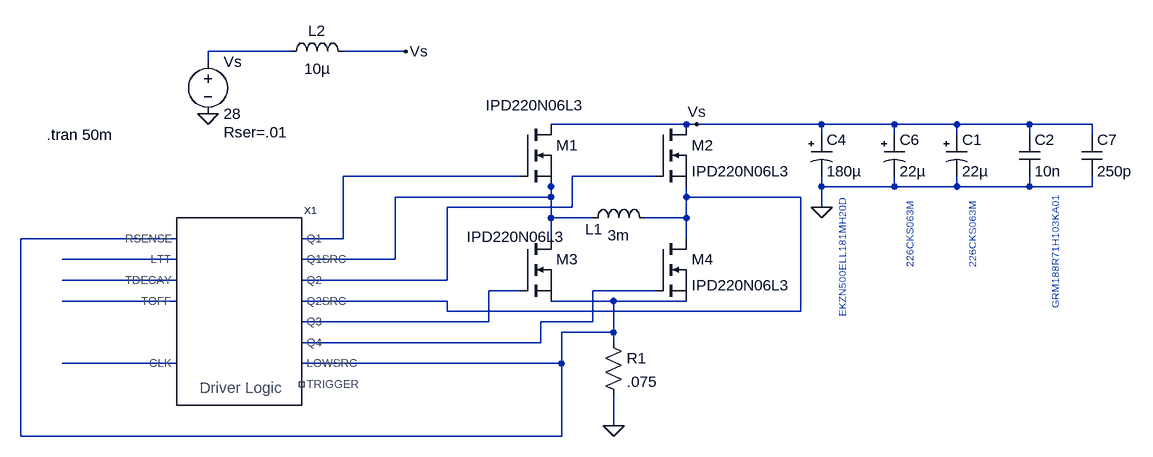
[diagram p0: schematic hbridge.asc]
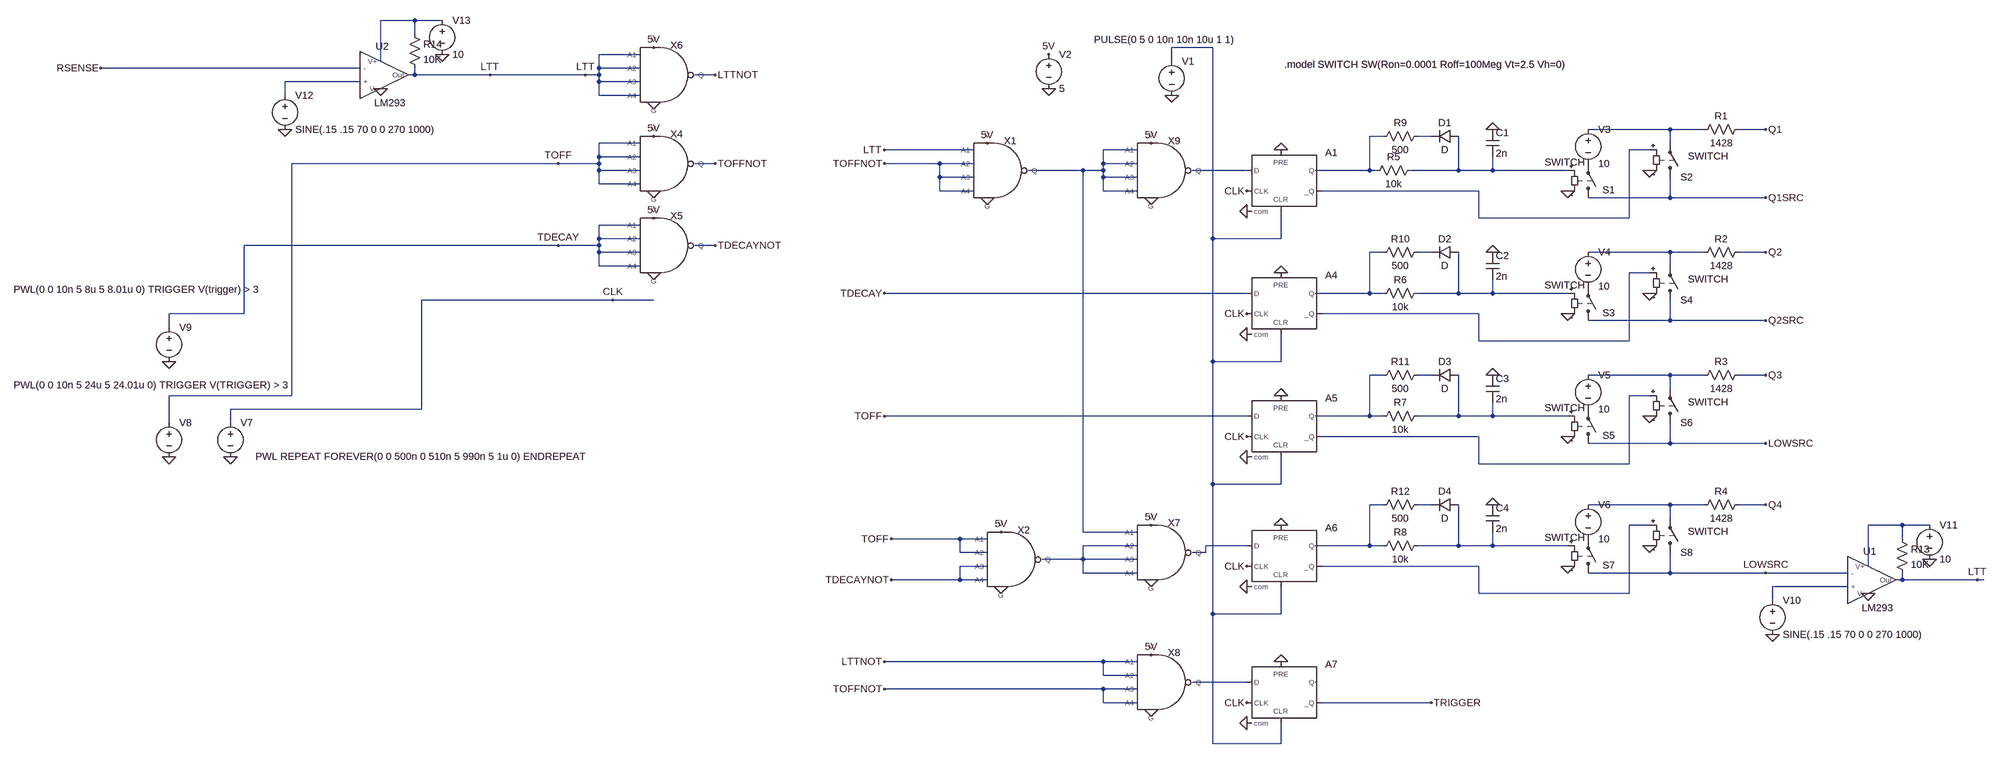
[diagram p1: sub-circuit state.asc]
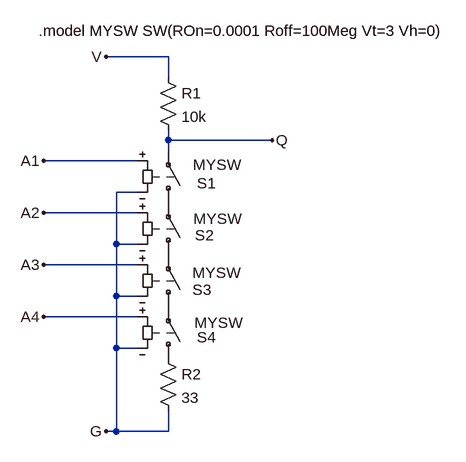
[diagram p2: sub-circuit mynand.asc]
hbridge.asc, the LTspice schematic file:
Version 4
SHEET 1 5128 2404
WIRE -176 -80 -304 -80
WIRE 0 -80 -96 -80
WIRE -304 -64 -304 -80
WIRE 432 32 224 32
WIRE 448 32 432 32
WIRE 640 32 448 32
WIRE 752 32 640 32
WIRE 848 32 752 32
WIRE 960 32 848 32
WIRE 1056 32 960 32
WIRE 640 48 640 32
WIRE 752 48 752 32
WIRE 848 48 848 32
WIRE 960 48 960 32
WIRE 1056 48 1056 32
WIRE 176 112 -96 112
WIRE 384 112 256 112
WIRE 224 128 224 112
WIRE 640 128 640 112
WIRE 752 128 752 112
WIRE 752 128 640 128
WIRE 848 128 848 112
WIRE 848 128 752 128
WIRE 960 128 960 112
WIRE 960 128 848 128
WIRE 1056 128 1056 112
WIRE 1056 128 960 128
WIRE 224 144 224 128
WIRE 224 144 -16 144
WIRE 432 144 432 128
WIRE 608 144 432 144
WIRE 256 160 256 112
WIRE 256 160 64 160
WIRE 640 160 640 128
WIRE 224 176 224 144
WIRE 288 176 224 176
WIRE 432 176 432 144
WIRE 432 176 368 176
WIRE -352 208 -592 208
WIRE -96 208 -96 112
WIRE -96 208 -160 208
WIRE 224 208 224 176
WIRE 432 208 432 176
WIRE -352 240 -528 240
WIRE -16 240 -16 144
WIRE -16 240 -160 240
WIRE -352 272 -528 272
WIRE 64 272 64 160
WIRE 64 272 -160 272
WIRE 176 288 128 288
WIRE 384 288 288 288
WIRE -352 304 -528 304
WIRE 64 304 -160 304
WIRE 320 304 224 304
WIRE 432 304 320 304
WIRE 64 320 64 304
WIRE 608 320 608 144
WIRE 608 320 64 320
WIRE 128 336 128 288
WIRE 128 336 -160 336
WIRE 288 336 288 288
WIRE 288 336 208 336
WIRE 320 352 320 304
WIRE 320 352 240 352
WIRE 208 368 208 336
WIRE 208 368 -160 368
WIRE 320 368 320 352
WIRE -352 400 -528 400
WIRE 240 400 240 352
WIRE 240 400 -160 400
WIRE 320 496 320 448
WIRE -592 512 -592 208
WIRE 240 512 240 400
WIRE 240 512 -592 512
FLAG 320 496 0
FLAG -304 16 0
FLAG 448 32 Vs
FLAG 0 -80 Vs
FLAG 640 160 0
SYMBOL nmos 176 32 R0
WINDOW 3 -53 -29 Left 2
SYMATTR Value IPD220N06L3
SYMATTR InstName M1
SYMBOL nmos 384 32 R0
SYMATTR InstName M2
SYMATTR Value IPD220N06L3
SYMBOL nmos 384 208 R0
SYMATTR InstName M4
SYMATTR Value IPD220N06L3
SYMBOL nmos 176 208 R0
WINDOW 3 -82 -3 Left 2
SYMATTR Value IPD220N06L3
SYMATTR InstName M3
SYMBOL ind 272 192 R270
WINDOW 0 -17 18 VTop 2
WINDOW 3 5 56 VBottom 2
SYMATTR InstName L1
SYMATTR Value 3m
SYMATTR SpiceLine Ipk=2 Rser=2.25
SYMBOL res 304 352 R0
SYMATTR InstName R1
SYMATTR Value .075
SYMATTR SpiceLine pwr=2
SYMBOL voltage -304 -80 R0
WINDOW 123 0 0 Left 2
WINDOW 39 24 124 Left 2
SYMATTR SpiceLine Rser=.01
SYMATTR InstName Vs
SYMATTR Value 28
SYMBOL ind -192 -64 R270
WINDOW 0 32 56 VTop 2
WINDOW 3 5 56 VBottom 2
SYMATTR InstName L2
SYMATTR Value 10µ
SYMBOL cap 944 48 R0
SYMATTR InstName C2
SYMATTR Value 10n
SYMATTR SpiceLine V=50 Irms=272m Rser=0.1 Lser=0
SYMBOL cap 1040 48 R0
SYMATTR InstName C7
SYMATTR Value 250p
SYMATTR SpiceLine V=50 Irms=10 Rser=100u Lser=.01p
SYMBOL polcap 736 48 R0
WINDOW 3 24 56 Left 2
SYMATTR Value 22µ
SYMATTR InstName C6
SYMATTR Description Capacitor
SYMATTR Type cap
SYMATTR SpiceLine V=63 Irms=368m Rser=7.5m
SYMBOL state -256 240 R0
SYMATTR InstName X1
SYMBOL polcap 832 48 R0
WINDOW 3 24 56 Left 2
SYMATTR Value 22µ
SYMATTR InstName C1
SYMATTR Description Capacitor
SYMATTR Type cap
SYMATTR SpiceLine V=63 Irms=368m Rser=7.5m
SYMBOL polcap 624 48 R0
WINDOW 3 24 56 Left 2
SYMATTR Value 180µ
SYMATTR InstName C4
SYMATTR Description Capacitor
SYMATTR Type cap
SYMATTR SpiceLine V=50 Irms=1.96 Rser=49m Lser=12n
TEXT -552 48 Left 2 !.tran 50m
TEXT 672 328 VLeft 1 ;EKZN500ELL181MH20D
TEXT 1000 144 VRight 1 ;GRM188R71H103KA01
TEXT 776 152 VRight 1 ;226CKS063M
TEXT 872 152 VRight 1 ;226CKS063M

state.asc, the sub-circuit schematic file:
Version 4
SHEET 1 2296 1748
WIRE -1504 -464 -1584 -464
WIRE -1440 -464 -1504 -464
WIRE -1504 -432 -1504 -464
WIRE 464 -400 368 -400
WIRE -976 -384 -1072 -384
WIRE -1584 -368 -1584 -464
WIRE 368 -368 368 -400
WIRE -1632 -352 -2240 -352
WIRE -1072 -352 -1072 -384
WIRE -976 -352 -1072 -352
WIRE -1504 -336 -1504 -352
WIRE -1504 -336 -1520 -336
WIRE -1328 -336 -1504 -336
WIRE -1104 -336 -1328 -336
WIRE -1072 -336 -1072 -352
WIRE -1072 -336 -1104 -336
WIRE -800 -336 -848 -336
WIRE -1632 -320 -1808 -320
WIRE -1072 -320 -1072 -336
WIRE -976 -320 -1072 -320
WIRE -1808 -288 -1808 -320
WIRE -1072 -288 -1072 -320
WIRE -976 -288 -1072 -288
WIRE 1536 -208 1344 -208
WIRE 1616 -208 1536 -208
WIRE 1760 -208 1696 -208
WIRE 864 -192 832 -192
WIRE 976 -192 944 -192
WIRE -976 -176 -1072 -176
WIRE 1536 -176 1536 -208
WIRE -96 -160 -320 -160
WIRE 288 -160 208 -160
WIRE 1488 -160 1440 -160
WIRE -1072 -144 -1072 -176
WIRE -976 -144 -1072 -144
WIRE -1168 -128 -1792 -128
WIRE -1072 -128 -1072 -144
WIRE -1072 -128 -1168 -128
WIRE -800 -128 -848 -128
WIRE -176 -128 -320 -128
WIRE -96 -128 -176 -128
WIRE 208 -128 208 -160
WIRE 288 -128 208 -128
WIRE -1072 -112 -1072 -128
WIRE -976 -112 -1072 -112
WIRE 160 -112 32 -112
WIRE 208 -112 208 -128
WIRE 208 -112 160 -112
WIRE 544 -112 416 -112
WIRE 832 -112 832 -192
WIRE 832 -112 704 -112
WIRE 848 -112 832 -112
WIRE 1040 -112 1040 -192
WIRE 1040 -112 928 -112
WIRE 1120 -112 1120 -144
WIRE 1120 -112 1040 -112
WIRE 1296 -112 1120 -112
WIRE -176 -96 -176 -128
WIRE -96 -96 -176 -96
WIRE 208 -96 208 -112
WIRE 288 -96 208 -96
WIRE -1072 -80 -1072 -112
WIRE -976 -80 -1072 -80
WIRE -176 -64 -176 -96
WIRE -96 -64 -176 -64
WIRE 208 -64 208 -96
WIRE 288 -64 208 -64
WIRE 1088 -64 720 -64
WIRE 1536 -48 1536 -96
WIRE 1536 -48 1344 -48
WIRE 1760 -48 1536 -48
WIRE 1088 0 1088 -64
WIRE 1440 0 1440 -160
WIRE 1440 0 1088 0
WIRE -976 16 -1072 16
WIRE -1072 48 -1072 16
WIRE -976 48 -1072 48
WIRE 464 48 464 -400
WIRE 624 48 624 -16
WIRE 624 48 464 48
WIRE -1168 64 -1904 64
WIRE -1072 64 -1072 48
WIRE -1072 64 -1168 64
WIRE -800 64 -848 64
WIRE -1072 80 -1072 64
WIRE -976 80 -1072 80
WIRE 864 80 832 80
WIRE 976 80 944 80
WIRE 1536 80 1344 80
WIRE 1616 80 1536 80
WIRE 1760 80 1696 80
WIRE -1072 112 -1072 80
WIRE -976 112 -1072 112
WIRE 1536 112 1536 80
WIRE 1488 128 1440 128
WIRE 544 176 -320 176
WIRE 832 176 832 80
WIRE 832 176 704 176
WIRE 864 176 832 176
WIRE 1040 176 1040 80
WIRE 1040 176 944 176
WIRE 1120 176 1120 144
WIRE 1120 176 1040 176
WIRE 1296 176 1120 176
WIRE -1040 192 -1488 192
WIRE -944 192 -1040 192
WIRE -1904 224 -1904 64
WIRE -1904 224 -2080 224
WIRE 1088 224 720 224
WIRE 1536 240 1536 192
WIRE 1536 240 1344 240
WIRE 1760 240 1536 240
WIRE -2080 256 -2080 224
WIRE 1088 288 1088 224
WIRE 1440 288 1440 128
WIRE 1440 288 1088 288
WIRE 464 336 464 48
WIRE 624 336 624 272
WIRE 624 336 464 336
WIRE 864 368 832 368
WIRE 976 368 944 368
WIRE 1536 368 1344 368
WIRE 1616 368 1536 368
WIRE 1760 368 1696 368
WIRE 1536 400 1536 368
WIRE -1792 416 -1792 -128
WIRE -1792 416 -2080 416
WIRE 1488 416 1440 416
WIRE -1488 448 -1488 192
WIRE -1488 448 -1936 448
WIRE 544 464 -320 464
WIRE 832 464 832 368
WIRE 832 464 704 464
WIRE 864 464 832 464
WIRE 1040 464 1040 368
WIRE 1040 464 944 464
WIRE 1120 464 1120 432
WIRE 1120 464 1040 464
WIRE 1296 464 1120 464
WIRE -2080 480 -2080 416
WIRE -1936 480 -1936 448
WIRE 1088 512 720 512
WIRE 1536 528 1536 480
WIRE 1536 528 1344 528
WIRE 1760 528 1536 528
WIRE 1088 576 1088 512
WIRE 1440 576 1440 416
WIRE 1440 576 1088 576
WIRE 464 624 464 336
WIRE 624 624 624 560
WIRE 624 624 464 624
WIRE 864 672 832 672
WIRE 976 672 944 672
WIRE 1536 672 1344 672
WIRE 1616 672 1536 672
WIRE 1760 672 1696 672
WIRE 1536 704 1536 672
WIRE 1488 720 1440 720
WIRE 2080 720 2000 720
WIRE 2144 720 2080 720
WIRE 160 736 160 -112
WIRE 288 736 160 736
WIRE -128 752 -304 752
WIRE -64 752 -128 752
WIRE 2080 752 2080 720
WIRE 288 768 160 768
WIRE 544 768 448 768
WIRE 832 768 832 672
WIRE 832 768 704 768
WIRE 864 768 832 768
WIRE 1040 768 1040 672
WIRE 1040 768 944 768
WIRE 1120 768 1120 736
WIRE 1120 768 1040 768
WIRE 1296 768 1120 768
WIRE -128 784 -128 752
WIRE -64 784 -128 784
WIRE 448 784 448 768
WIRE 448 784 416 784
WIRE 160 800 160 768
WIRE 160 800 64 800
WIRE 288 800 160 800
WIRE -64 816 -128 816
WIRE 1088 816 720 816
WIRE 2000 816 2000 720
WIRE 160 832 160 800
WIRE 288 832 160 832
WIRE 1536 832 1536 784
WIRE 1536 832 1344 832
WIRE 1760 832 1536 832
WIRE 1952 832 1760 832
WIRE -128 848 -128 816
WIRE -128 848 -304 848
WIRE -64 848 -128 848
WIRE 2080 848 2080 832
WIRE 2080 848 2064 848
WIRE 2256 848 2080 848
WIRE 2272 848 2256 848
WIRE 1952 864 1776 864
WIRE 1088 880 1088 816
WIRE 1440 880 1440 720
WIRE 1440 880 1088 880
WIRE 1776 896 1776 864
WIRE 464 928 464 624
WIRE 624 928 624 864
WIRE 624 928 464 928
WIRE 208 1040 -320 1040
WIRE 288 1040 208 1040
WIRE 208 1072 208 1040
WIRE 288 1072 208 1072
WIRE 544 1088 416 1088
WIRE 208 1104 -320 1104
WIRE 288 1104 208 1104
WIRE 208 1136 208 1104
WIRE 288 1136 208 1136
WIRE 976 1136 720 1136
WIRE 464 1232 464 928
WIRE 624 1232 624 1184
WIRE 624 1232 464 1232
FLAG 976 1136 TRIGGER
FLAG -1104 -336 LTT
FLAG -1168 -128 TOFF
FLAG -1168 64 TDECAY
FLAG 368 -288 0
FLAG 624 -160 0
FLAG 544 -16 0
FLAG 544 -64 CLK
FLAG 80 -304 0
FLAG 80 -384 5V
FLAG -944 -192 5V
FLAG -944 -64 0
FLAG -944 0 5V
FLAG -944 128 0
FLAG -944 -400 5V
FLAG -944 -272 0
FLAG -800 -336 LTTNOT
FLAG -800 -128 TOFFNOT
FLAG -800 64 TDECAYNOT
FLAG -1040 192 CLK
FLAG 1760 -208 Q1
FLAG 1760 -48 Q1SRC
FLAG 1296 -64 0
FLAG 1488 -112 0
FLAG 624 128 0
FLAG 544 272 0
FLAG 544 224 CLK
FLAG 1760 80 Q2
FLAG 1760 240 Q2SRC
FLAG 1296 224 0
FLAG 1488 176 0
FLAG 624 416 0
FLAG 544 560 0
FLAG 544 512 CLK
FLAG 1760 368 Q3
FLAG 1760 528 LOWSRC
FLAG 1296 512 0
FLAG 1488 464 0
FLAG 624 720 0
FLAG 544 864 0
FLAG 544 816 CLK
FLAG 1760 672 Q4
FLAG 1760 832 LOWSRC
FLAG 1296 816 0
FLAG 1488 768 0
FLAG 1120 -208 0
FLAG 1120 80 0
FLAG 1120 368 0
FLAG 1120 672 0
FLAG -1936 560 0
FLAG -2080 560 0
FLAG -2080 336 0
FLAG 1776 976 0
FLAG 2256 848 LTT
FLAG 2144 800 0
FLAG 2000 880 0
FLAG -1808 -208 0
FLAG -1328 -336 LTT
FLAG -1440 -384 0
FLAG -1584 -304 0
FLAG -2240 -352 RSENSE
FLAG 544 1136 CLK
FLAG 544 1184 0
FLAG 624 1040 0
FLAG -64 -176 5V
FLAG 320 720 5V
FLAG 320 1024 5V
FLAG -64 -48 0
FLAG 320 848 0
FLAG 320 1152 0
FLAG -320 -160 LTT
FLAG -320 -128 TOFFNOT
FLAG 320 -176 5V
FLAG 320 -48 0
FLAG -320 176 TDECAY
FLAG -320 464 TOFF
FLAG -320 1040 LTTNOT
FLAG -320 1104 TOFFNOT
FLAG -32 736 5V
FLAG -32 864 0
FLAG -304 752 TOFF
FLAG -304 848 TDECAYNOT
SYMBOL Digital\\dflop 624 -160 R0
WINDOW 3 8 12 Invisible 2
SYMATTR Value Vhigh 5 Vlow 0 Trise 20n Tfall 20n
SYMATTR InstName A1
SYMBOL voltage 368 -384 R0
WINDOW 3 -182 -35 Left 2
WINDOW 123 0 0 Left 2
WINDOW 39 0 0 Left 2
SYMATTR Value PULSE(0 5 0 10n 10n 10u 1 1)
SYMATTR InstName V1
SYMBOL voltage 80 -400 R0
WINDOW 123 0 0 Left 2
WINDOW 39 0 0 Left 2
SYMATTR InstName V2
SYMATTR Value 5
SYMBOL myNand -960 -176 R0
SYMATTR InstName X4
SYMBOL myNand -960 16 R0
SYMATTR InstName X5
SYMBOL myNand -960 -384 R0
SYMATTR InstName X6
SYMBOL sw 1344 -32 M180
WINDOW 0 34 34 Left 2
WINDOW 3 -102 99 Left 2
SYMATTR InstName S1
SYMATTR Value SWITCH
SYMBOL voltage 1344 -224 R0
WINDOW 123 0 0 Left 2
WINDOW 39 0 0 Left 2
SYMATTR InstName V3
SYMATTR Value 10
SYMBOL res 1712 -224 R90
WINDOW 0 0 56 VBottom 2
WINDOW 3 32 56 VTop 2
SYMATTR InstName R1
SYMATTR Value 1428
SYMBOL sw 1536 -80 M180
WINDOW 3 42 65 Left 2
SYMATTR Value SWITCH
SYMATTR InstName S2
SYMBOL Digital\\dflop 624 128 R0
WINDOW 3 8 12 Invisible 2
SYMATTR Value Vhigh 5 Vlow 0 Trise 20n Tfall 20n
SYMATTR InstName A4
SYMBOL sw 1344 256 M180
WINDOW 0 34 34 Left 2
WINDOW 3 -102 99 Left 2
SYMATTR InstName S3
SYMATTR Value SWITCH
SYMBOL voltage 1344 64 R0
WINDOW 123 0 0 Left 2
WINDOW 39 0 0 Left 2
SYMATTR InstName V4
SYMATTR Value 10
SYMBOL res 1712 64 R90
WINDOW 0 0 56 VBottom 2
WINDOW 3 32 56 VTop 2
SYMATTR InstName R2
SYMATTR Value 1428
SYMBOL sw 1536 208 M180
WINDOW 3 42 65 Left 2
SYMATTR Value SWITCH
SYMATTR InstName S4
SYMBOL Digital\\dflop 624 416 R0
WINDOW 3 8 12 Invisible 2
SYMATTR Value Vhigh 5 Vlow 0 Trise 20n Tfall 20n
SYMATTR InstName A5
SYMBOL sw 1344 544 M180
WINDOW 0 34 34 Left 2
WINDOW 3 -102 99 Left 2
SYMATTR InstName S5
SYMATTR Value SWITCH
SYMBOL voltage 1344 352 R0
WINDOW 123 0 0 Left 2
WINDOW 39 0 0 Left 2
SYMATTR InstName V5
SYMATTR Value 10
SYMBOL res 1712 352 R90
WINDOW 0 0 56 VBottom 2
WINDOW 3 32 56 VTop 2
SYMATTR InstName R3
SYMATTR Value 1428
SYMBOL sw 1536 496 M180
WINDOW 3 42 65 Left 2
SYMATTR Value SWITCH
SYMATTR InstName S6
SYMBOL Digital\\dflop 624 720 R0
WINDOW 3 8 12 Invisible 2
SYMATTR Value Vhigh 5 Vlow 0 Trise 20n Tfall 20n
SYMATTR InstName A6
SYMBOL sw 1344 848 M180
WINDOW 0 34 34 Left 2
WINDOW 3 -102 99 Left 2
SYMATTR InstName S7
SYMATTR Value SWITCH
SYMBOL voltage 1344 656 R0
WINDOW 123 0 0 Left 2
WINDOW 39 0 0 Left 2
SYMATTR InstName V6
SYMATTR Value 10
SYMBOL res 1712 656 R90
WINDOW 0 0 56 VBottom 2
WINDOW 3 32 56 VTop 2
SYMATTR InstName R4
SYMATTR Value 1428
SYMBOL sw 1536 800 M180
WINDOW 3 42 65 Left 2
SYMATTR Value SWITCH
SYMATTR InstName S8
SYMBOL res 944 -128 R90
WINDOW 0 0 56 VBottom 2
WINDOW 3 32 56 VTop 2
SYMATTR InstName R5
SYMATTR Value 10k
SYMBOL cap 1104 -208 R0
SYMATTR InstName C1
SYMATTR Value 2n
SYMBOL res 960 160 R90
WINDOW 0 0 56 VBottom 2
WINDOW 3 32 56 VTop 2
SYMATTR InstName R6
SYMATTR Value 10k
SYMBOL cap 1104 80 R0
SYMATTR InstName C2
SYMATTR Value 2n
SYMBOL res 960 448 R90
WINDOW 0 0 56 VBottom 2
WINDOW 3 32 56 VTop 2
SYMATTR InstName R7
SYMATTR Value 10k
SYMBOL cap 1104 368 R0
SYMATTR InstName C3
SYMATTR Value 2n
SYMBOL res 960 752 R90
WINDOW 0 0 56 VBottom 2
WINDOW 3 32 56 VTop 2
SYMATTR InstName R8
SYMATTR Value 10k
SYMBOL cap 1104 672 R0
SYMATTR InstName C4
SYMATTR Value 2n
SYMBOL diode 1040 -208 R90
WINDOW 0 0 32 VBottom 2
WINDOW 3 32 32 VTop 2
SYMATTR InstName D1
SYMBOL res 960 -208 R90
WINDOW 0 0 56 VBottom 2
WINDOW 3 32 56 VTop 2
SYMATTR InstName R9
SYMATTR Value 500
SYMBOL diode 1040 64 R90
WINDOW 0 0 32 VBottom 2
WINDOW 3 32 32 VTop 2
SYMATTR InstName D2
SYMBOL res 960 64 R90
WINDOW 0 0 56 VBottom 2
WINDOW 3 32 56 VTop 2
SYMATTR InstName R10
SYMATTR Value 500
SYMBOL diode 1040 352 R90
WINDOW 0 0 32 VBottom 2
WINDOW 3 32 32 VTop 2
SYMATTR InstName D3
SYMBOL res 960 352 R90
WINDOW 0 0 56 VBottom 2
WINDOW 3 32 56 VTop 2
SYMATTR InstName R11
SYMATTR Value 500
SYMBOL diode 1040 656 R90
WINDOW 0 0 32 VBottom 2
WINDOW 3 32 32 VTop 2
SYMATTR InstName D4
SYMBOL res 960 656 R90
WINDOW 0 0 56 VBottom 2
WINDOW 3 32 56 VTop 2
SYMATTR InstName R12
SYMATTR Value 500
SYMBOL voltage -1936 464 R0
WINDOW 3 59 95 Left 2
SYMATTR Value PWL REPEAT FOREVER(0 0 500n 0 510n 5 990n 5 1u 0) ENDREPEAT
SYMATTR InstName V7
SYMBOL voltage -2080 464 R0
WINDOW 123 0 0 Left 2
WINDOW 39 0 0 Left 2
WINDOW 3 -364 -73 Left 2
SYMATTR Value PWL(0 0 10n 5 24u 5 24.01u 0) TRIGGER V(TRIGGER) > 3
SYMATTR InstName V8
SYMBOL voltage -2080 240 R0
WINDOW 123 0 0 Left 2
WINDOW 39 0 0 Left 2
WINDOW 3 -364 -73 Left 2
SYMATTR Value PWL(0 0 10n 5 8u 5 8.01u 0) TRIGGER V(trigger) > 3
SYMATTR InstName V9
SYMBOL AutoGenerated\\LM293 2000 864 R0
SYMATTR InstName U1
SYMBOL voltage 1776 880 R0
WINDOW 123 0 0 Left 2
WINDOW 39 0 0 Left 2
SYMATTR InstName V10
SYMATTR Value SINE(.15 .15 70 0 0 270 1000)
SYMBOL voltage 2144 704 R0
WINDOW 123 0 0 Left 2
WINDOW 39 0 0 Left 2
SYMATTR InstName V11
SYMATTR Value 10
SYMBOL res 2064 736 R0
SYMATTR InstName R13
SYMATTR Value 10K
SYMBOL AutoGenerated\\LM293 -1584 -320 R0
SYMATTR InstName U2
SYMBOL voltage -1808 -304 R0
WINDOW 123 0 0 Left 2
WINDOW 39 0 0 Left 2
SYMATTR InstName V12
SYMATTR Value SINE(.15 .15 70 0 0 270 1000)
SYMBOL voltage -1440 -480 R0
WINDOW 123 0 0 Left 2
WINDOW 39 0 0 Left 2
SYMATTR InstName V13
SYMATTR Value 10
SYMBOL res -1520 -448 R0
SYMATTR InstName R14
SYMATTR Value 10K
SYMBOL Digital\\dflop 624 1040 R0
WINDOW 3 8 12 Invisible 2
SYMATTR Value Vhigh 5 Vlow 0 Trise 1n Tfall 1n
SYMATTR InstName A7
SYMBOL myNand -80 -160 R0
SYMATTR InstName X1
SYMBOL myNand 304 736 R0
SYMATTR InstName X7
SYMBOL myNand 304 1040 R0
SYMATTR InstName X8
SYMBOL myNand 304 -160 R0
SYMATTR InstName X9
SYMBOL myNand -48 752 R0
SYMATTR InstName X2
TEXT 632 -360 Left 2 !.model SWITCH SW(Ron=0.0001 Roff=100Meg Vt=2.5 Vh=0)

mynand.asc, the sub-circuit schematic file:
Version 4
SHEET 1 880 680
WIRE 208 -64 112 -64
WIRE 208 -32 208 -64
WIRE 208 64 208 48
WIRE 368 64 208 64
WIRE 208 80 208 64
WIRE 160 96 16 96
WIRE 160 144 128 144
WIRE 160 176 16 176
WIRE 128 224 128 144
WIRE 160 224 128 224
WIRE 160 256 16 256
WIRE 128 304 128 224
WIRE 160 304 128 304
WIRE 160 336 16 336
WIRE 128 384 128 304
WIRE 160 384 128 384
WIRE 128 512 128 384
WIRE 128 512 112 512
WIRE 208 512 208 480
WIRE 208 512 128 512
FLAG 368 64 Q
FLAG 16 96 A1
FLAG 16 176 A2
FLAG 16 256 A3
FLAG 16 336 A4
FLAG 112 -64 V
FLAG 112 512 G
SYMBOL sw 208 176 M180
WINDOW 0 44 46 Left 2
WINDOW 3 38 74 Left 2
SYMATTR InstName S1
SYMATTR Value MYSW
SYMBOL sw 208 256 M180
WINDOW 0 41 46 Left 2
WINDOW 3 39 71 Left 2
SYMATTR InstName S2
SYMATTR Value MYSW
SYMBOL res 192 -48 R0
SYMATTR InstName R1
SYMATTR Value 10k
SYMBOL sw 208 336 M180
WINDOW 0 37 42 Left 2
WINDOW 3 37 68 Left 2
SYMATTR InstName S3
SYMATTR Value MYSW
SYMBOL sw 208 416 M180
WINDOW 0 44 49 Left 2
WINDOW 3 40 71 Left 2
SYMATTR InstName S4
SYMATTR Value MYSW
SYMBOL res 192 384 R0
SYMATTR InstName R2
SYMATTR Value 33
TEXT 8 -104 Left 2 !.model MYSW SW(ROn=0.0001 Roff=100Meg Vt=3 Vh=0)

The netlist it stands for:
* hbridge.asc
M1 Vs N002 N004 N004 IPD220N06L3
M2 Vs N003 N005 N005 IPD220N06L3
M4 N005 N010 N006 N006 IPD220N06L3
M3 N004 N009 N006 N006 IPD220N06L3
L1 N004 N005 3m Ipk=2 Rser=2.25
R1 N006 0 .075 pwr=2
Vs N001 0 28 Rser=.01
L2 N001 Vs 10µ
C2 Vs 0 10n V=50 Irms=272m Rser=0.1 Lser=0
C7 Vs 0 250p V=50 Irms=10 Rser=100u Lser=.01p
C6 Vs 0 22µ V=63 Irms=368m Rser=7.5m
XX1 N007 N008 N011 N012 N002 N003 N009 N010 NC_01 N004 N005 N006 N006 state
C1 Vs 0 22µ V=63 Irms=368m Rser=7.5m
C4 Vs 0 180µ V=50 Irms=1.96 Rser=49m Lser=12n

* block symbol definitions
.subckt state LTT TDECAY TOFF CLK Q1 Q2 Q3 Q4 TRIGGER Q1SRC Q2SRC LOWSRC RSENSE
A1 N009 0 CLK 0 N002 N008 N005 0 DFLOP Vhigh 5 Vlow 0 Trise 20n Tfall 20n
V1 N002 0 PULSE(0 5 0 10n 10n 10u 1 1)
V2 5V 0 5
XX4 TOFF TOFF TOFFNOT TOFF TOFF 5V 0 mynand
XX5 TDECAY TDECAY TDECAYNOT TDECAY TDECAY 5V 0 mynand
XX6 LTT LTT LTTNOT LTT LTT 5V 0 mynand
S1 Q1SRC P001 N010 0 SWITCH
V3 N004 P001 10
R1 Q1 N004 1428
S2 Q1SRC N004 N008 0 SWITCH
A4 TDECAY 0 CLK 0 N002 N014 N011 0 DFLOP Vhigh 5 Vlow 0 Trise 20n Tfall 20n
S3 Q2SRC P002 N015 0 SWITCH
V4 N013 P002 10
R2 Q2 N013 1428
S4 Q2SRC N013 N014 0 SWITCH
A5 TOFF 0 CLK 0 N002 N019 N016 0 DFLOP Vhigh 5 Vlow 0 Trise 20n Tfall 20n
S5 LOWSRC P003 N020 0 SWITCH
V5 N018 P003 10
R3 Q3 N018 1428
S6 LOWSRC N018 N019 0 SWITCH
A6 N027 0 CLK 0 N002 N024 N021 0 DFLOP Vhigh 5 Vlow 0 Trise 20n Tfall 20n
S7 LOWSRC P004 N028 0 SWITCH
V6 N023 P004 10
R4 Q4 N023 1428
S8 LOWSRC N023 N024 0 SWITCH
R5 N010 N005 10k
C1 0 N010 2n
R6 N015 N011 10k
C2 0 N015 2n
R7 N020 N016 10k
C3 0 N020 2n
R8 N028 N021 10k
C4 0 N028 2n
D1 N010 N006 D
R9 N006 N005 500
D2 N015 N012 D
R10 N012 N011 500
D3 N020 N017 D
R11 N017 N016 500
D4 N028 N022 D
R12 N022 N021 500
V7 CLK 0 PWL REPEAT FOREVER(0 0 500n 0 510n 5 990n 5 1u 0) ENDREPEAT
V8 TOFF 0 PWL(0 0 10n 5 24u 5 24.01u 0) TRIGGER V(TRIGGER) > 3
V9 TDECAY 0 PWL(0 0 10n 5 8u 5 8.01u 0) TRIGGER V(trigger) > 3
XU1 N029 LOWSRC N025 0 LTT LM293  ; pins + - V+ V- Out
V10 N029 0 SINE(.15 .15 70 0 0 270 1000)
V11 N025 0 10
R13 N025 LTT 10K
XU2 N003 RSENSE N001 0 LTT LM293  ; pins + - V+ V- Out
V12 N003 0 SINE(.15 .15 70 0 0 270 1000)
V13 N001 0 10
R14 N001 LTT 10K
A7 N030 0 CLK 0 N002 TRIGGER 0 0 DFLOP Vhigh 5 Vlow 0 Trise 1n Tfall 1n
XX1 LTT TOFFNOT N007 TOFFNOT TOFFNOT 5V 0 mynand
XX7 N007 N026 N027 N026 N026 5V 0 mynand
XX8 LTTNOT LTTNOT N030 TOFFNOT TOFFNOT 5V 0 mynand
XX9 N007 N007 N009 N007 N007 5V 0 mynand
XX2 TOFF TOFF N026 TDECAYNOT TDECAYNOT 5V 0 mynand
.model SWITCH SW(Ron=0.0001 Roff=100Meg Vt=2.5 Vh=0)
.ends state

.subckt mynand A1 A2 Q A3 A4 V G
S1 P001 Q A1 G MYSW
S2 P002 P001 A2 G MYSW
R1 V Q 10k
S3 P003 P002 A3 G MYSW
S4 P004 P003 A4 G MYSW
R2 P004 G 33
.model MYSW SW(ROn=0.0001 Roff=100Meg Vt=3 Vh=0)
.ends mynand

.model D D
.lib standard.dio
.model NMOS NMOS
.model PMOS PMOS
.lib standard.mos
.tran 50m
* EKZN500ELL181MH20D
* GRM188R71H103KA01
* 226CKS063M
* 226CKS063M
.lib LM293.5_1
.backanno
.end